# Altium schematic sheet Robo_Seguidor_de_Linha.SchDoc
size A4; SheetNumber: 1; SheetTotal: 1
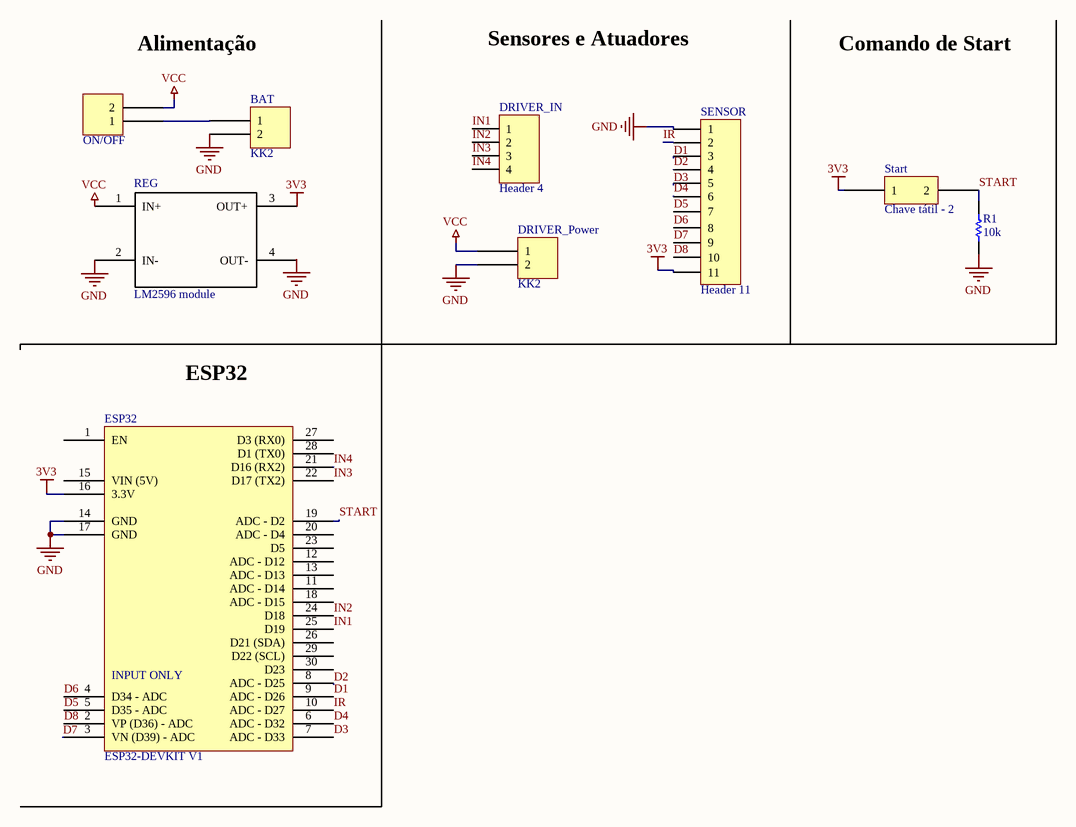
[diagram p0: Robo_Seguidor_de_Linha.SchDoc]

## Parts
BAT  KK2  [BORNE]
DRIVER_IN  Header 4  [Header1x4 - Female]
DRIVER_Power  KK2  [BORNE]
ESP32  ESP32-DEVKIT V1  [ESP32-DEVKIT V1 with HeaderConnector]
ON/OFF  KK2  [Chave tátil - 6]  (value not drawn)
R1  value 10k  [RESISTOR THT 5mm]  (hidden comment: Resistor THT)
REG  LM2596 module  [LM2596 module]
SENSOR  Header 11  [Header1x9]
Start  Chave tátil - 2  [Chave tátil - 2]

## Nets
3V3: ESP32.16(3.3V) REG.3(OUT+) SENSOR.11 Start.1
GND: BAT.2 DRIVER_Power.2 ESP32.14(GND) ESP32.17(GND) R1.1 REG.2(IN-) SENSOR.1
VCC: DRIVER_Power.1 ON/OFF.2 REG.1(IN+)
D1: ESP32.9(ADC_-_D26) SENSOR.3
D2: ESP32.8(ADC_-_D25) SENSOR.4
D3: ESP32.7(ADC_-_D33) SENSOR.5
D4: ESP32.6(ADC_-_D32) SENSOR.6
D5: ESP32.5(D35_-_ADC) SENSOR.7
D6: ESP32.4(D34_-_ADC) SENSOR.8
D7: ESP32.3(VN_(D39)_-_ADC) SENSOR.9
D8: ESP32.2(VP_(D36)_-_ADC) SENSOR.10
IN1: DRIVER_IN.1 ESP32.25(D19)
IN2: DRIVER_IN.2 ESP32.24(D18)
IN3: DRIVER_IN.3 ESP32.22(D17_(TX2))
IN4: DRIVER_IN.4 ESP32.21(D16_(RX2))
IR: ESP32.10(ADC_-_D27) SENSOR.2
START: ESP32.19(ADC_-_D2) R1.2 Start.2
NetBAT_1: BAT.1 ON/OFF.1

Not connected (* = marked no-connect by the designer): ESP32 1(EN) 11(ADC_-_D14) 12(ADC_-_D12) 13(ADC_-_D13) 15(VIN_(5V)) 18(ADC_-_D15) 20(ADC_-_D4) 23(D5) 26(D21_(SDA)) 27(D3_(RX0)) 28(D1_(TX0)) 29(D22_(SCL)) 30(D23); REG 4(OUT-)

## Notes on the sheet
- Alimentação
- Sensores e Atuadores
- Comando de Start
- (near ESP32) ESP32
- Labels drawn without touching a wire or pin: GND
- (in symbol ESP32-DEVKIT V1) INPUT ONLY

## Library data of the parts
BAT DRIVER_Power ON/OFF = KK2: KK Connector, 2 ways
DRIVER_IN = Header 4: Header, 4-Pin; LatestRevisionDate: 17-Jul-2002; LatestRevisionNote: Re-released for DXP Platform.; Publisher: Altium Limited
ESP32 = ESP32-DEVKIT V1: Placa ESP32 com 30 pinos - Modelo DEVKIT V1
REG = LM2596 module: Step-down regulável
SENSOR = Header 11: Header, 11-Pin; LatestRevisionDate: 17-Jul-2002; LatestRevisionNote: Re-released for DXP Platform.; Publisher: Altium Limited
Start = Chave tátil - 2: Chave tátil/pushbutton/momentary switch